# EAGLE schematic untitled (EAGLE 7.6.0)
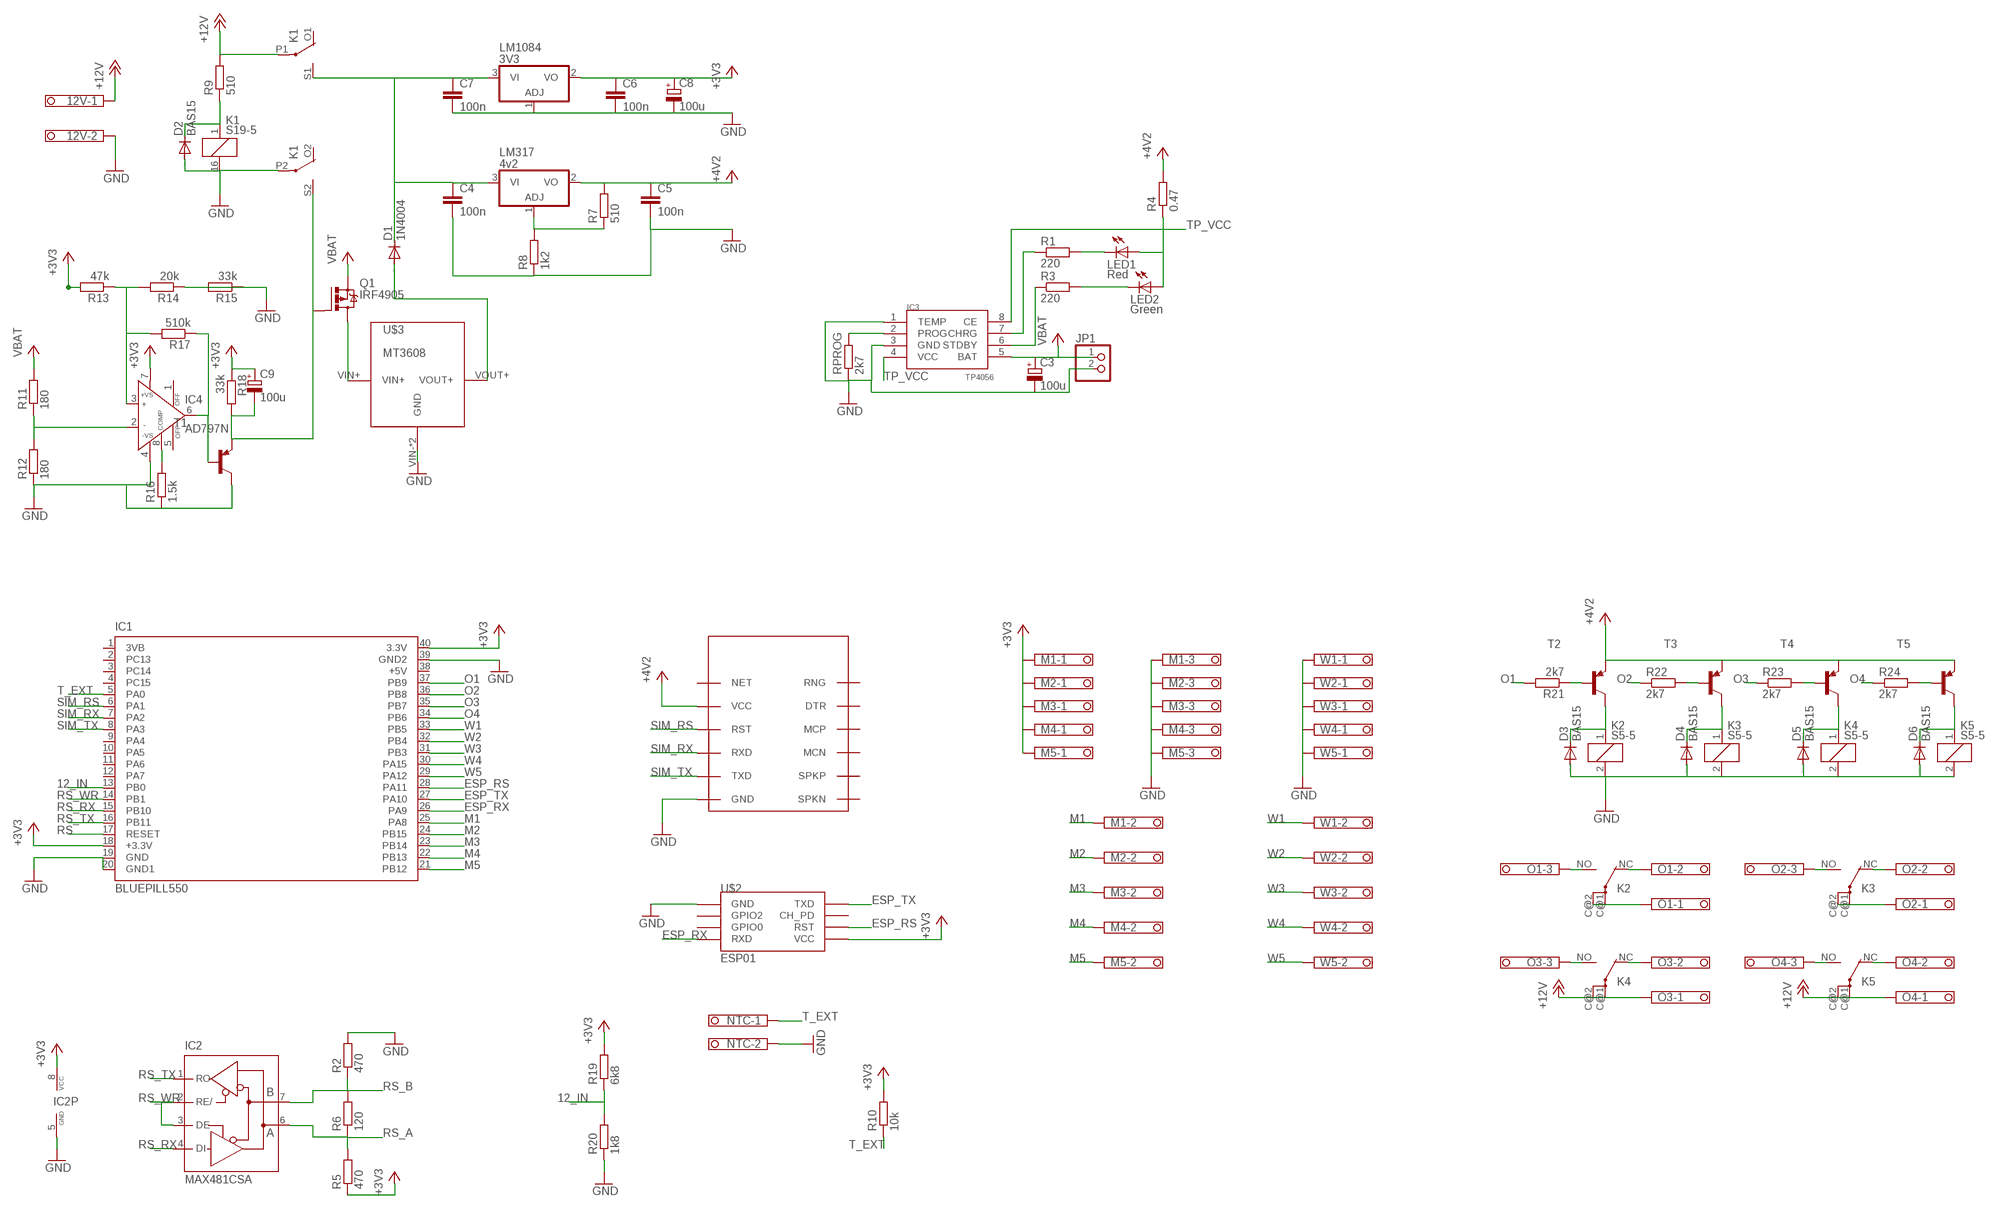
[diagram p0: schematic, sheet 1]

## Parts
12V  1751248  [1751248]
C3  100u  CPOL-EUE2,5-6E  [E2,5-6E]
C4  100n  C-EUC2012  [C2012]
C5  100n  C-EUC2012  [C2012]
C6  100n  C-EUC2012  [C2012]
C7  100n  C-EUC2012  [C2012]
C8  100u  CPOL-EUE2,5-6E  [E2,5-6E]
C9  100u  CPOL-EUE2,5-6E  [E2,5-6E]
D1  1N4004  [DO41-10]
D2  BAS15  [DO34-7]
D3  BAS15  [DO34-7]
D4  BAS15  [DO34-7]
D5  BAS15  [DO34-7]
D6  BAS15  [DO34-7]
IC1  BLUEPILL550  [DIL40]
IC2  MAX481CSA  [SO08]
IC3  TP4056  [SOP-8]
IC4  AD797N  [DIL08]
JP1  PINHD-1X2  [1X02]
K1  S19-5  351  [351]
K2  S5-5  HY1-5V  [HY]
K3  S5-5  HY1-5V  [HY]
K4  S5-5  HY1-5V  [HY]
K5  S5-5  HY1-5V  [HY]
LED1  Red  LEDCHIP-LED0805  [CHIP-LED0805]
LED2  Green  LEDCHIP-LED0805  [CHIP-LED0805]
LM317  4v2  317T  [TO220H]
LM1084  3V3  317T  [TO220H]
M1  1751251  [1751251]
M2  1751251  [1751251]
M3  1751251  [1751251]
M4  1751251  [1751251]
M5  1751251  [1751251]
NTC  1751248  [1751248]
O1  1751251  [1751251]
O2  1751251  [1751251]
O3  1751251  [1751251]
O4  1751251  [1751251]
Q1  IRF4905  [TO220BH]
R1  220  R-EU_R0805  [R0805]
R2  470  R-EU_0204/5  [0204/5]
R3  220  R-EU_R0805  [R0805]
R4  0.47  R-EU_0207/12  [0207/12]
R5  470  R-EU_0204/5  [0204/5]
R6  120  R-EU_0204/7  [0204/7]
R7  510  R-EU_0204/7  [0204/7]
R8  1k2  R-EU_0204/7  [0204/7]
R9  510  R-EU_0204/7  [0204/7]
R10  10k  R-EU_0204/5  [0204/5]
R11  180  R-EU_0204/7  [0204/7]
R12  180  R-EU_0204/7  [0204/7]
R13  47k  R-EU_0204/7  [0204/7]
R14  20k  R-EU_0204/7  [0204/7]
R15  33k  R-EU_0204/7  [0204/7]
R16  1.5k  R-EU_0204/7  [0204/7]
R17  510k  R-EU_0204/7  [0204/7]
R18  33k  R-EU_0204/7  [0204/7]
R19  6k8  R-EU_0204/5  [0204/5]
R20  1k8  R-EU_0204/5  [0204/5]
R21  2k7  R-EU_0204/7  [0204/7]
R22  2k7  R-EU_0204/7  [0204/7]
R23  2k7  R-EU_0204/7  [0204/7]
R24  2k7  R-EU_0204/7  [0204/7]
RPROG  2k7  R-EU_0204/7  [0204/7]
T1  BC327-40-PNP-TO92-EBC  [TO92-EBC]
T2  BC327-40-PNP-TO92-EBC  [TO92-EBC]
T3  BC327-40-PNP-TO92-EBC  [TO92-EBC]
T4  BC327-40-PNP-TO92-EBC  [TO92-EBC]
T5  BC327-40-PNP-TO92-EBC  [TO92-EBC]
U$1  SIM800L  [SIM-CORE]
U$2  ESP01  [ESP01]
U$3  MT3608  [MT3608]
W1  1751248  [1751248]
W2  1751248  [1751248]
W3  1751248  [1751248]
W4  1751248  [1751248]
W5  1751248  [1751248]

## Nets
12_IN: IC1.13(PB0) R19.1 R20.2
+3V3: C6.1 C8.+ C9.+ IC1.18(+3.3V) IC1.40(3.3V) IC2.8(VCC) IC4.7(+VS) LM1084.2(VO) M1.1 M2.1 M3.1 M4.1 M5.1 R5.1 R10.2 R13.2 R18.1 R19.2 U$2.VCC
+12V: 12V.1 K1.P1(2:P) K4.C@1(2:P) K4.C@2(2:P) K5.C@1(2:P) K5.C@2(2:P) O3.1 O4.1 R9.2
ESP_RS: IC1.28(PA11) U$2.RST
ESP_RX: IC1.26(PA9) U$2.RX(RXD)
ESP_TX: IC1.27(PA10) U$2.TX(TXD)
GND: 12V.2 C3.- C4.2 C5.2 C6.2 C7.2 C8.- D2.A D3.A D4.A D5.A D6.A IC1.19(GND) IC1.20(GND1) IC1.39(GND2) IC2.5(GND) IC3.1(TEMP) IC3.3(GND) IC4.4(-VS) JP1.2 K1.16 K1.P2(3:P) K2.2 K3.2 K4.2 K5.2 LM1084.1(ADJ) M1.3 M2.3 M3.3 M4.3 M5.3 NTC.2 R2.2 R8.1 R12.1 R14.1 R15.1 R15.2 R16.1 R20.1 RPROG.1 T1.C U$1.GND U$2.GND U$3.VIN-(GND) U$3.VOUT-(GND) W1.1 W2.1 W3.1 W4.1 W5.1
M1: IC1.25(PA8) M1.2
M2: IC1.24(PB15) M2.2
M3: IC1.23(PB14) M3.2
M4: IC1.22(PB13) M4.2
M5: IC1.21(PB12) M5.2
N$1: IC3.2(PROG) RPROG.2
N$2: D2.C K1.1 R9.1
N$3: LED1.C R1.2
N$4: LED2.C R3.2
N$5: IC3.7(CHRG) R1.1
N$6: IC3.6(STDBY) R3.1
N$7: C4.1 C7.1 D1.C K1.S1(2:S) LM317.3(VI) LM1084.3(VI)
N$8: Q1.D U$3.VIN+
N$9: IC4.3(IN+) R13.1 R14.2 R17.2
N$10: D3.C K2.1 T2.C
N$11: IC4.2(IN-) R11.1 R12.2
N$12: IC4.8(COMP) R16.2
N$13: IC4.6(OUT) R17.1 T1.B
N$14: LM317.1(ADJ) R7.1 R8.2
N$15: C9.- K1.S2(3:S) Q1.G R18.2 T1.E
N$16: D4.C K3.1 T3.C
N$17: D5.C K4.1 T4.C
N$18: D6.C K5.1 T5.C
N$19: R21.1 T2.B
N$20: R22.2 T3.B
N$21: R23.2 T4.B
N$22: R24.2 T5.B
N$23: K4.NO(2:S) O3.3
N$24: K4.NC(2:O) O3.2
N$25: K5.NO(2:S) O4.3
N$26: K5.NC(2:O) O4.2
N$27: K2.NO(2:S) O1.3
N$28: K2.C@1(2:P) K2.C@2(2:P) O1.1
N$29: K2.NC(2:O) O1.2
N$30: K3.NO(2:S) O2.3
N$31: K3.NC(2:O) O2.2
N$32: K3.C@1(2:P) K3.C@2(2:P) O2.1
O1: IC1.37(PB9) R21.2
O2: IC1.36(PB8) R22.1
O3: IC1.35(PB7) R23.1
O4: IC1.34(PB6) R24.1
RS: IC1.17(RESET)
RS_A: IC2.6(A) R5.2 R6.1
RS_B: IC2.7(B) R2.1 R6.2
RS_RX: IC1.15(PB10) IC2.4(DI)
RS_TX: IC1.16(PB11) IC2.1(RO)
RS_WR: IC1.14(PB1) IC2.2(RE/) IC2.3(DE)
SIM_RS: IC1.6(PA1) U$1.RST
SIM_RX: IC1.7(PA2) U$1.RXD
SIM_TX: IC1.8(PA3) U$1.TXD
T_EXT: IC1.5(PA0) NTC.1 R10.1
TP_VCC: IC3.4(VCC) IC3.8(CE) LED1.A LED2.A R4.1
VCC: C3.+ C5.1 IC3.5(BAT) JP1.1 LM317.2(VO) Q1.S R4.2 R7.2 R11.2 T2.E T3.E T4.E T5.E U$1.VCC ; supply symbol labelled VBAT, +4V2
VOUT+: D1.A U$3.VOUT+
W1: IC1.33(PB5) W1.2
W2: IC1.32(PB4) W2.2
W3: IC1.31(PB3) W3.2
W4: IC1.30(PA15) W4.2
W5: IC1.29(PA12) W5.2
Unconnected: IC1.1(3VB) IC1.2(PC13) IC1.3(PC14) IC1.4(PC15) IC1.9(PA4) IC1.10(PA5) IC1.38(+5V) IC4.1(OFF) IC4.5(OFF) K1.O1(2:O) K1.O2(3:O) U$1.DTR U$1.MCN U$1.MCP U$1.NET U$1.RNG U$1.SPKN U$1.SPKP U$2.CH_PD U$2.GPIO0 U$2.GPIO2

## Power pins joined to a net without a drawn wire
PA6: IC1.11(PA6)
PA7: IC1.12(PA7)

## Library data of the parts
12V NTC W1-W5 = con-phoenix-350:1751248: MKDS 1/ 2-3,5 Printklemme Nennstrom: 10 A Bemessungsspannung: 160 V Raster: 3,5 mm Polzahl: 2 Montageart: Löten Anschlussart: Schraubanschluss Anschlussrichtung vom Leiter zur Platine: 0° Source: http://eshop.phoenixcontact.com .. 1751248.pdf; OC_FARNELL: unknown; OC_NEWARK: unknown
C3 C8 C9 = resistor:CPOL-EU: POLARIZED CAPACITOR, European symbol
C4-C7 = resistor:C-EU: CAPACITOR, European symbol
D1 = diode:1N4004: DIODE general purpose rectifier, 1 A
D2-D6 = diode:BAS15: DIODE high speed
IC1 = STM32BluePill:BLUEPILL: BluePill STM32F108T6 Dev Board Source: http://www.stm32duino.com; 0: x; BLUEP: 1; MF: BluePill; MPN: BluePill; X: 0
IC2 = maxim:MAX481CSA: RS485 TRANSEIVER; MF: MAXIM; MPN: MAX481CSA; OC_FARNELL: unknown; OC_NEWARK: 90C3817
IC3 = TP4056:TP4056
IC4 = analog-devices:AD797: Ultralow Distortion, Ultralow Noise Op Amp Source: http://www.analog.com/static/imported-files/data_sheets/AD797.pdf; MF: ALTERA CORPORATION; MPN: AD797ANZ; OC_FARNELL: 9603778; OC_NEWARK: 59K6088
JP1 = pinhead:PINHD-1X2: PIN HEADER
K1 = relay:351: RELAY 2 x switch, Omron; OC_FARNELL: unknown; OC_NEWARK: unknown
K2-K5 = relay:HY1*: Non-polarized 1 Form C Relay NAiS Source: http://www.mew-europe.com/.. en_ds_61012_0000.pdf; MF: AROMAT/ MATSUSHITA; MPN: HY1-5V; OC_FARNELL: unknown; OC_NEWARK: 10C6692
LED1 LED2 = led:LED: LED OSRAM: - CHIPLED LG R971, LG N971, LY N971, LG Q971, LY Q971, LO R971, LY R971 LH N974, LH R974 LS Q976, LO Q976, LY Q976 LO Q996 - Hyper CHIPLED LW Q18S LB Q993, LB Q99A, LB R99A - SideLED LS A670, LO A670, LY A670, LG A670, LP A670 LB A673, LV A673, LT A673, LW A673 LH A674 LY A675 LS A676, LA A676, LO A676, LY A676, LW A676 LS A679, LY A679, LG A679 - Hyper Micro SIDELED® LS Y876, LA Y876, LO Y876, LY Y876 LT Y87S - SmartLED LW L88C, LW L88S LB L89C, LB L89S, LG L890 LS L89K, LO L89K, LY L89K LS L896, LA L896, LO L896, LY L896 - TOPLED LS T670, LO T670, LY T670, LG T670, LP T670 LSG T670, LSP T670, LSY T670, LOP T670, LYG T670 LG T671, LOG T671, LSG T671 LB T673, LV T673, LT T673, LW T673 LH T674 LS T676, LA T676, LO T676, LY T676, LB T676, LH T676, LSB T676, LW T676 LB T67C, LV T67C, LT T67C, LS T67K, LO T67K, LY T67K, LW E67C LS E67B, LA E67B, LO E67B, LY E67B, LB E67C, LV E67C, LT E67C LW T67C LS T679, LY T679, LG T679 LS T770, LO T770, LY T770, LG T770, LP T770 LB T773, LV T773, LT T773, LW T773 LH T774 LS E675, LA E675, LY E675, LS T675 LS T776, LA T776, LO T776, LY T776, LB T776 LHGB T686 LT T68C, LB T68C - Hyper Mini TOPLED® LB M676 - Mini TOPLED Santana® LG M470 LS M47K, LO M47K, LY M47K Source: http://www.osram.convergy.de LUXEON: - LUMILED® LXK2-PW12-R00, LXK2-PW12-S00, LXK2-PW14-U00, LXK2-PW14-V00 LXK2-PM12-R00, LXK2-PM12-S00, LXK2-PM14-U00 LXK2-PE12-Q00, LXK2-PE12-R00, LXK2-PE12-S00, LXK2-PE14-T00, LXK2-PE14-U00 LXK2-PB12-K00, LXK2-PB12-L00, LXK2-PB12-M00, LXK2-PB14-N00, LXK2-PB14-P00, LXK2-PB14-Q00 LXK2-PR12-L00, LXK2-PR12-M00, LXK2-PR14-Q00, LXK2-PR14-R00 LXK2-PD12-Q00, LXK2-PD12-R00, LXK2-PD12-S00 LXK2-PH12-R00, LXK2-PH12-S00 LXK2-PL12-P00, LXK2-PL12-Q00, LXK2-PL12-R00 Source: www.luxeon.com KINGBRIGHT: KA-3528ASYC Source: www.kingbright.com
LM317 LM1084 = linear:*317: Positive VOLTAGE REGULATOR
M1-M5 O1-O4 = con-phoenix-350:1751251: MKDS 1/ 3-3,5 Printklemme Nennstrom: 10 A Bemessungsspannung: 160 V Raster: 3,5 mm Polzahl: 3 Montageart: Löten Anschlussart: Schraubanschluss Anschlussrichtung vom Leiter zur Platine: 0° Source: http://eshop.phoenixcontact.com .. 1751251.pdf; OC_FARNELL: unknown; OC_NEWARK: unknown
Q1 = transistor-power:IRF4905: P-Channel HEXFET® Power MOSFET RDS(on)= 0.02 Ohm, ID = -74A Source: http://www.irf.com/product-info/datasheets/data/irf4905pbf.pdf
R1-R9 R11-R18 R21-R24 RPROG = resistor:R-EU_: RESISTOR, European symbol
R10 R19 R20 = rcl:R-EU_: RESISTOR, European symbol
T1-T5 = transistor:*-PNP-: PNP Transistror
U$1 = SIM800L:SIM800L
U$2 = ESP_8266:ESP01: ESP8266 Wifi module 01
U$3 = dc-dc-converter2:MT3608